# Altium schematic sheet Sheet1.SchDoc
size A4; SheetNumber: 1; SheetTotal: 1
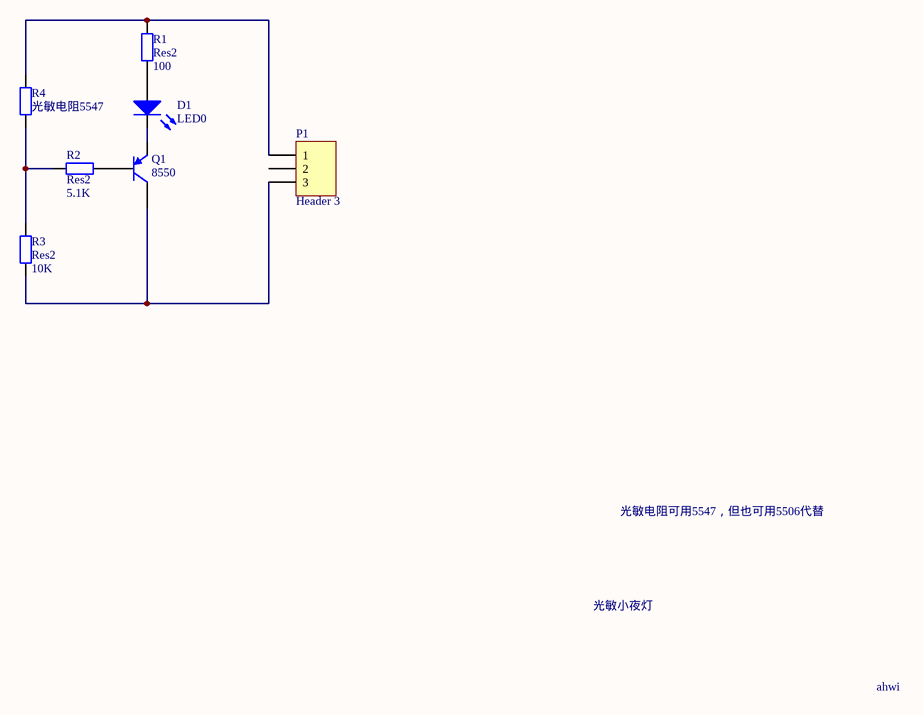
[diagram p0: Sheet1.SchDoc]

## Parts
D1  LED0  [6-0805_M]
P1  Header 3  [PCBComponent_1]
Q1  8550  [SOT-23B_L]
R1  Res2  value 100  [6-0805_M]
R2  Res2  value 5.1K  [6-0805_M]
R3  Res2  value 10K  [6-0805_M]
R4  光敏电阻5547  [R38]

## Nets
NetD1_1: D1.1(A) R1.1
NetD1_2: D1.2(K) Q1.3(E)
NetP1_1: P1.1 R1.2 R4.2
NetP1_3: P1.3 Q1.1(C) R3.1
NetQ1_2: Q1.2(B) R2.2
NetR2_1: R2.1 R3.2 R4.1

Not connected (* = marked no-connect by the designer): P1 2

## Notes on the sheet
- 光敏电阻可用5547，但也可用5506代替
- 光敏小夜灯
- ahwi

## Library data of the parts
D1 = LED0: Typical INFRARED GaAs LED; Published: 8-Jun-2000; LatestRevisionDate: 08-Jul-2005; LatestRevisionNote: Mech Layer 1 removed.; PackageReference: LED-0; Publisher: Altium Limited; PackageDescription: LED; 2 Leads
P1 = Header 3: Header, 3-Pin; LatestRevisionDate: 17-Jul-2002; LatestRevisionNote: Re-released for DXP Platform.; Publisher: Altium Limited
Q1 = PNP: PNP Bipolar Transistor; Published: 8-Jun-2000; LatestRevisionDate: 29-May-2009; LatestRevisionNote: IPC-7351 Footprint Added.; PackageVersion: Aug-1999; PackageReference: SOT-23B; Publisher: Altium Limited; PackageDescription: 3-Pin SOT-23 Package 0.95 mm Pitch, 2.4 mm Lead Span
R1-R4 = Res2: Resistor; Published: 8-Jun-2000; LatestRevisionDate: 17-Jul-2002; LatestRevisionNote: Re-released for DXP Platform.; PackageReference: AXIAL-0.4; Publisher: Altium Limited; PackageDescription: Axial Device, Thru-Hole; 2 Leads; 0.4 in Pin Spacing